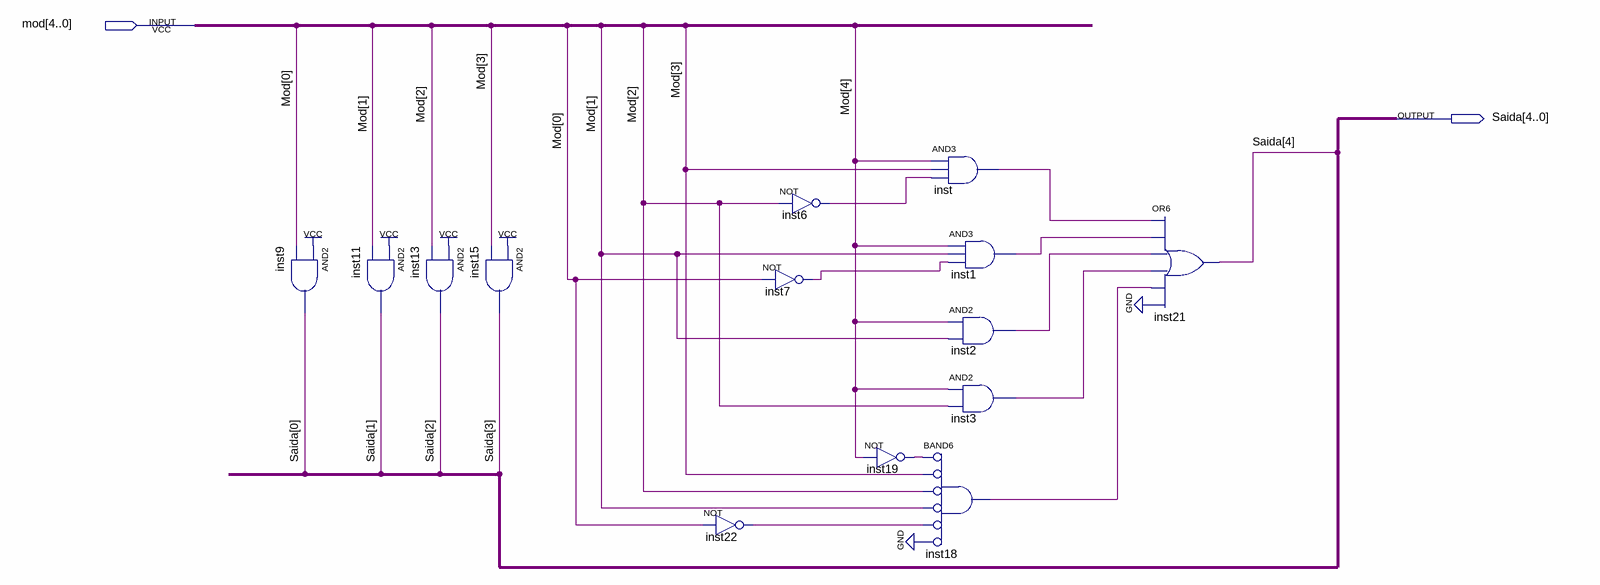
[diagram p0: schematic sheet]
// Quartus schematic Zero_CB.bdf as structural Verilog: 14 symbols, 2 pins
module Zero_CB (
  input  [4:0] mod,
  output [4:0] Saida
);

  wire inst1_out, inst2_out, inst3_out, inst6_out, inst7_out, inst18_out, inst19_out, inst22_out, inst_out;

  and inst9 (Saida[0], 1'b1, mod[0]);
  and inst11 (Saida[1], 1'b1, mod[1]);
  and inst13 (Saida[2], 1'b1, mod[2]);
  and inst15 (Saida[3], 1'b1, mod[3]);
  not inst22 (inst22_out, mod[0]);
  not inst6 (inst6_out, mod[2]);
  not inst7 (inst7_out, mod[0]);
  not inst19 (inst19_out, mod[4]);
  and inst (inst_out, mod[4], mod[3], inst6_out);
  and inst1 (inst1_out, mod[4], mod[1], inst7_out);
  and inst2 (inst2_out, mod[4], mod[1]);
  and inst3 (inst3_out, mod[4], mod[2]);
  and inst18 (inst18_out, ~inst19_out, ~mod[3], ~mod[2], ~mod[1], ~inst22_out, ~1'b0);  // BAND6
  or inst21 (Saida[4], inst_out, inst1_out, inst2_out, inst3_out, inst18_out, 1'b0);
endmodule
